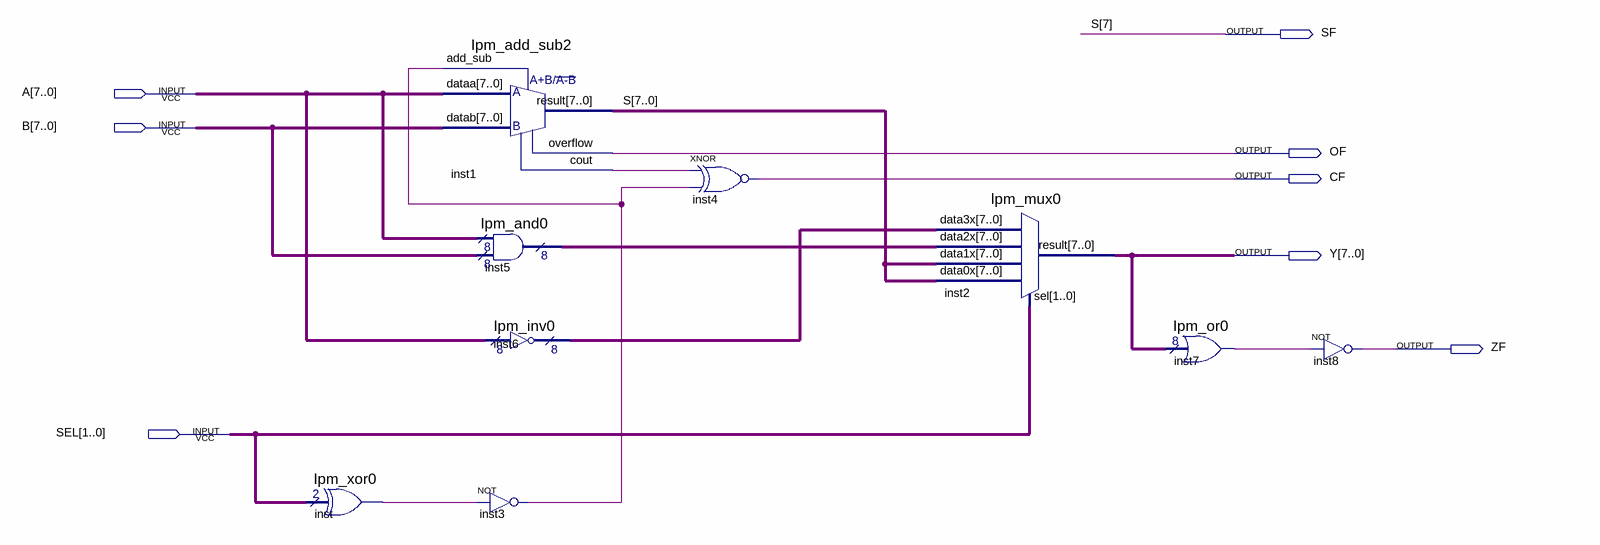
[diagram p0: schematic sheet]
// Quartus schematic shiyanALU.bdf as structural Verilog: 9 symbols, 8 pins
module shiyanALU (
  input  [7:0] A,
  input  [7:0] B,
  input  [1:0] SEL,
  output SF,
  output OF,
  output CF,
  output [7:0] Y,
  output ZF
);

  wire inst1_cout, inst3_out, inst7_result, inst_result;
  wire [6:0] S;
  wire [7:0] inst5_result, inst6_result;

  Ipm_xor0 inst (.data(SEL), .result(inst_result));
  Ipm_add_sub2 inst1 (.dataa(A), .datab(B), .add_sub(inst3_out), .result({SF, S}), .overflow(OF), .cout(inst1_cout));
  Ipm_and0 inst5 (.data0x(A), .data1x(B), .result(inst5_result));
  Ipm_inv0 inst6 (.data(A), .result(inst6_result));
  not inst3 (inst3_out, inst_result);
  xnor inst4 (CF, inst1_cout, inst3_out);
  lpm_mux0 inst2 (
    .data3x(inst6_result), .data2x(inst5_result), .data1x({SF, S}), .data0x({SF, S}), .sel(SEL), .result(Y));
  Ipm_or0 inst7 (.data(Y), .result(inst7_result));
  not inst8 (ZF, inst7_result);

  // Other names for the same wires on the sheet: S[7] = SF
endmodule
